# EAGLE design satshield_fresh_start_right_way-2010-01-24 (EAGLE 5.06)
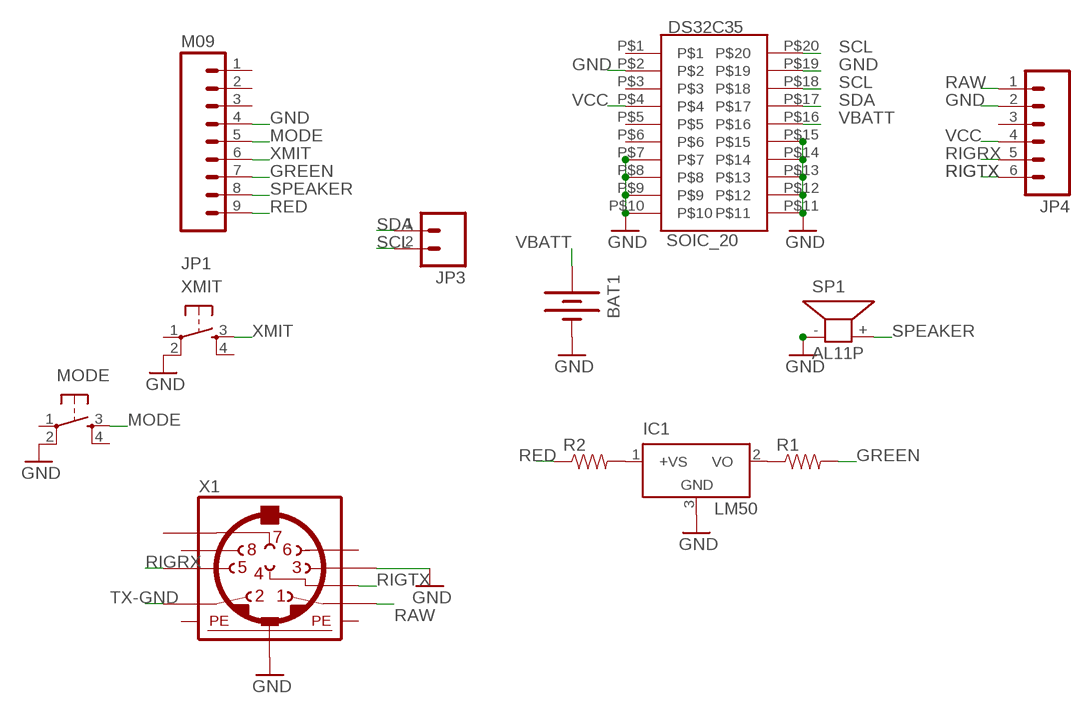
[diagram p0: schematic, sheet 1]

## Parts
BAT1  BATTERY12MM  [BATTCON_12MM]
DS32C35  SOIC_20  [SO20W]
IC1  LM50  [SOT23]
JP1  M09  [1X09]
JP3  M02PTH  [1X02]
JP4  M06SIP  [1X06]
MODE  TAC_SWITCHPTH  [TACTILE-PTH]
R1  RESISTOR1206  [1206]
R2  RESISTOR1206  [1206]
SP1  AL11P  [AL11P]
X1  MINI_DIN_8  [M_DIN8]
XMIT  TAC_SWITCHPTH  [TACTILE-PTH]

## Nets
GND: BAT1.GND(-) DS32C35.P$2 DS32C35.P$7 DS32C35.P$8 DS32C35.P$9 DS32C35.P$10 DS32C35.P$11 DS32C35.P$12 DS32C35.P$13 DS32C35.P$14 DS32C35.P$15 DS32C35.P$19 IC1.3(GND) JP1.4 JP4.2 MODE.2 SP1.- X1.3 X1.SH2(PE2) XMIT.2
GREEN: JP1.7 R1.2
MODE: JP1.5 MODE.3
N$1: IC1.2(VO) R1.1
N$3: IC1.1(+VS) R2.2
RAW: JP4.1 X1.1
RED: JP1.9 R2.1
RIGRX: JP4.5 X1.5
RIGTX: JP4.6 X1.4
SCL: DS32C35.P$18 DS32C35.P$20 JP3.2
SDA: DS32C35.P$17 JP3.1
SPEAKER: JP1.8 SP1.+
TX-GND: X1.2
VBATT: BAT1.PWR@1(+) DS32C35.P$16
VCC: DS32C35.P$4 JP4.4
XMIT: JP1.6 XMIT.3
Unconnected: DS32C35.P$1 DS32C35.P$3 DS32C35.P$5 DS32C35.P$6 JP1.1 JP1.2 JP1.3 JP4.3 MODE.1 MODE.4 X1.6 X1.7 X1.8 XMIT.1 XMIT.4

## Power pins joined to a net without a drawn wire
PE1: X1.SH1(PE1)
PE3: X1.SH3(PE3)

## Library data of the parts
BAT1 = SparkFun:BATTERY: Battery Holders Various common sizes : AA, AAA, 20mm coin cell and 12mm coin cell.
DS32C35 = SparkFun:SOIC_20
IC1 = linear:LM50: SOT-23 Single-Supply Centigrade Temperature Sensor Vout = (10mV/°C x Temp °C) +5mmmV Source: http://cache.national.com/ds/LM/LM50.pdf
JP1 = SparkFun:M09: Header 9 Standard 9-pin 0.1" header. Use with straight break away headers (SKU : PRT-00116), right angle break away headers (PRT-00553), swiss pins (PRT-00743), machine pins (PRT-00117), and female headers (PRT-00115).
JP3 = SparkFun:M02: Header 2 Standard 2-pin 0.1" header. Use with straight break away headers (SKU : PRT-00116), right angle break away headers (PRT-00553), swiss pins (PRT-00743), machine pins (PRT-00117), and female headers (PRT-00115). Molex polarized connector foot print use with SKU : PRT-08233 with associated crimp pins and housings.
JP4 = SparkFun:M06: Header 6 Standard 6-pin 0.1" header. Use with straight break away headers (SKU : PRT-00116), right angle break away headers (PRT-00553), swiss pins (PRT-00743), machine pins (PRT-00117), and female headers (PRT-00115). Molex polarized connector foot print use with SKU : PRT-08094 with associated crimp pins and housings. NOTES ON THE VARIANTS LOCK and LOCK_LONGPADS... This footprint was designed to help hold the alignment of a through-hole component (i.e. 6-pin header) while soldering it into place. You may notice that each hole has been shifted either up or down by 0.005 of an inch from it's more standard position (which is a perfectly straight line). This slight alteration caused the pins (the squares in the middle) to touch the edges of the holes. Because they are alternating, it causes a "brace" to hold the component in place. 0.005 has proven to be the perfect amount of "off-center" position when using our standard breakaway headers. Although looks a little odd when you look at the bare footprint, once you have a header in there, the alteration is very hard to notice. Also, if you push a header all the way into place, it is covered up entirely on the bottom side. This idea of altering the position of holes to aid alignment will be further integrated into the Sparkfun Library for other footprints. It can help hold any component with 3 or more connection pins.
MODE XMIT = SparkFun:TAC_SWITCH: Momentary Switch Button commonly used for reset or general input. Spark Fun Electronics SKU : COM-00097
R1 R2 = SparkFun:RESISTOR: Resistor Basic schematic elements and footprints for 0603, 1206, and PTH 1/10th watt (small) resistors.
SP1 = buzzer:AL11P: SPEAKER Source: Buerklin
X1 = mini_din_update:MINI_DIN_8

## Board
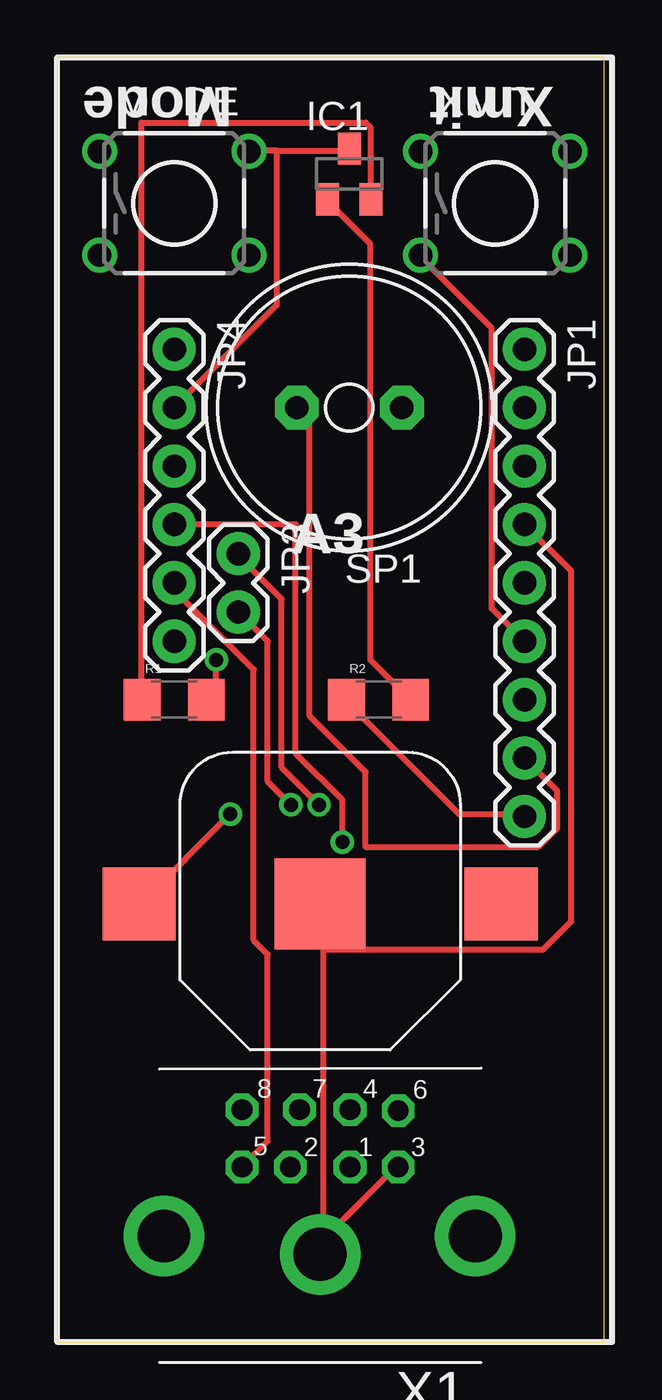
[diagram p1: board, top side]
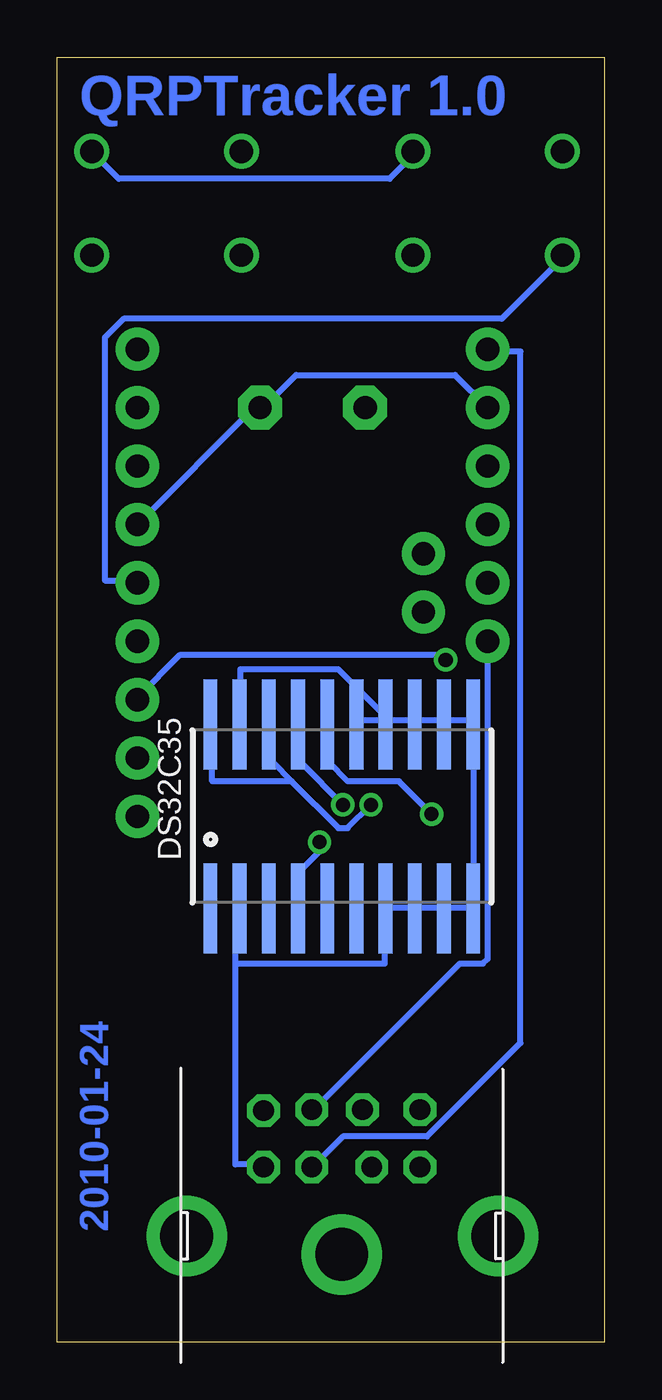
[diagram p2: board, bottom side, seen from below]

Size 23.8 x 55.87 mm. Coordinates in mm from the lower left corner, seen from the top.
Outline: 0,0 23.8,0 23.8,55.87 0,55.87 0,0
Copper layers (1*16): Top 0.035mm / dielectric 1.5mm / Bottom 0.035mm
Design rules "default": minimum track width 10mil, minimum drill 24mil, track to track 8mil, track to pad 8mil, pad to pad 8mil, via to via 8mil, smd to smd 8mil, copper to edge 40mil, drill to drill 8mil, minimum pad ring 10mil, minimum via ring 8mil, stop-mask expansion 4mil, vias tented up to drill 0mil, thermal gap 10mil

### Footprints (pad centres in the part's own frame; a part is rotated, then mirrored left to right if it is on the bottom)
BATTCON_12MM = smd 3.962 x 3.962: GND 0,0 | smd 3.175 x 3.175: PWR@1 -7.874,0; PWR@2 7.874,0
SO20W = smd 0.6 x 3.9: P$1 -5.715,-4; P$2 -4.445,-4; P$3 -3.175,-4; P$4 -1.905,-4; P$5 -0.635,-4; P$6 0.635,-4; P$7 1.905,-4; P$8 3.175,-4; P$9 4.445,-4; P$10 5.715,-4; P$11 5.715,4; P$12 4.445,4; P$13 3.175,4; P$14 1.905,4; P$15 0.635,4; P$16 -0.635,4; P$17 -1.905,4; P$18 -3.175,4; P$19 -4.445,4; P$20 -5.715,4
SOT23 = smd 1 x 1.4: 1 -0.95,-1.1; 2 0.95,-1.1; 3 0,1.1
1X09 = drill 1.016 pad 1.88 round: 1 0,0; 2 2.54,0; 3 5.08,0; 4 7.62,0; 5 10.16,0; 6 12.7,0; 7 15.24,0; 8 17.78,0; 9 20.32,0
1X02 = drill 1.016 pad 1.88 round: 1 0,0; 2 2.54,0
1X06 = drill 1.016 pad 1.88 round: 1 0,0; 2 2.54,0; 3 5.08,0; 4 7.62,0; 5 10.16,0; 6 12.7,0
TACTILE-PTH = drill 1.016 round: 1 -3.251,2.261; 2 3.251,2.261; 3 -3.251,-2.261; 4 3.251,-2.261
1206 = smd 1.6 x 1.8: 1 -1.4,0; 2 1.4,0
AL11P = drill 1.016 pad 1.905 octagon: + 2.286,0; - -2.286,0
M_DIN8 = drill 0.9 pad 1.422 octagon: 1 -1.3,-3.8; 2 1.3,-3.8; 3 -3.4,-3.8; 4 -1.3,-6.3; 5 3.4,-3.8; 6 -3.4,-6.25; 7 0.9,-6.3; 8 3.4,-6.3 | drill 2.3 pad 3.5 round: SH1 6.8,-0.8; SH2 0,0; SH3 -6.75,-0.8

### Placement (x,y rotation side)
BAT1  11.43,19.05 0 top
DS32C35  11.43,22.86 0 bottom
IC1  12.7,50.8 0 top
JP1  20.32,43.18 270 top
JP3  7.87,34.29 270 top
JP4  5.08,43.18 270 top
MODE  5.08,49.53 0 top
R1  5.08,27.94 0 top
R2  13.97,27.94 0 top
SP1  12.7,40.64 180 top
X1  11.43,3.81 180 top
XMIT  19.05,49.53 0 top

### Tracks (layer width: path | path; a pad name or v marks a point on that pad's centre or on a via)
GND
  Top 0.254: 9.55,51.82 8.33,51.82 MODE.2 | 9.55,51.82 12.6,51.82 IC1.3 | JP4.2 9.55,45.11 9.55,51.82 | 11.58,4.47 14.63,7.52 X1.3 | 11.58,4.47 11.58,3.86 X1.SH2 11.58,4.47 | 11.58,4.47 11.58,17.07 | 11.58,17.07 11.58,18.9 BAT1.GND | JP1.4 22.35,33.53 22.35,18.29 21.13,17.07 11.58,17.07
  Bottom 0.254: JP1.4 15.24,40.64 SP1.- 14.83,40.64 13.41,42.06 6.5,42.06 JP4.2 | XMIT.2 22.15,51.61 21.13,50.6 9.35,50.6 8.33,51.61 MODE.2 | 9.35,27.03 8.33,27.03 DS32C35.P$13 8.13,27.03 7.11,27.03 DS32C35.P$12 6.91,27.03 5.89,27.03 DS32C35.P$11 5.69,26.82 5.69,18.9 DS32C35.P$10 5.89,18.9 6.91,18.9 DS32C35.P$9 7.11,18.9 8.13,18.9 DS32C35.P$8 8.33,18.9 9.35,18.9 DS32C35.P$7 9.55,18.69 9.55,16.46 16.05,16.46 | DS32C35.P$15 10.77,27.03 9.55,27.03 DS32C35.P$14 9.35,27.03 | 9.35,27.03 11.58,29.26 15.85,29.26 15.85,27.03 DS32C35.P$19 | 16.05,16.46 16.05,7.72 14.83,7.72 X1.3 | 16.05,16.46 16.05,18.69 DS32C35.P$2
GREEN  (via drill 0.61)
  Top 0.254: v6.91,29.67 6.91,28.45 6.5,28.04 R1.2
  Bottom 0.254: v6.91,29.67 7.11,29.87 18.49,29.87 20.32,28.04 JP1.7
MODE
  Bottom 0.254: MODE.3 1.83,47.14 4.47,44.5 20.93,44.5 21.74,43.69 21.74,33.12 20.32,33.12 JP1.5
N$1
  Top 0.254: IC1.2 13.61,49.78 13.61,52.83 13.41,53.03 3.66,53.03 3.66,28.04 R1.1
N$3
  Top 0.254: IC1.1 11.79,49.58 13.61,47.75 13.61,29.67 15.24,28.04 R2.2
RAW
  Bottom 0.254: X1.1 12.6,7.72 11.38,8.94 7.72,8.94 3.66,13.01 3.66,43.08 5.08,43.08 JP4.1
RED
  Top 0.254: R2.1 12.6,27.84 17.48,22.96 20.32,22.96 JP1.9
RIGRX
  Top 0.254: X1.5 8.13,7.72 9.14,8.74 9.14,16.87 8.53,17.48 8.53,29.26 5.08,32.72 JP4.5
RIGTX
  Bottom 0.254: JP4.6 5.08,16.66 5.28,16.46 6.3,16.46 12.6,10.16 X1.4
SCL  (via drill 0.61)
  Top 0.254: v10.16,23.37 9.14,24.38 9.14,30.48 JP3.2
  Bottom 0.254: v10.16,23.37 11.18,22.35 11.58,22.35 13.61,24.38 | 13.61,24.38 14.43,25.2 14.43,26.82 DS32C35.P$18 | 13.61,24.38 17.07,24.38 17.07,26.82 DS32C35.P$20
SDA  (via drill 0.61)
  Top 0.254: v11.38,23.37 9.75,24.99 9.75,32.31 7.92,34.14 JP3.1
  Bottom 0.254: v11.38,23.37 13.21,25.2 13.21,26.82 DS32C35.P$17
SPEAKER
  Top 0.254: JP1.8 21.74,23.98 21.74,22.35 20.93,21.54 13.41,21.54 13.41,24.79 10.97,27.23 10.97,40.23 10.57,40.64 SP1.+
VBATT  (via drill 0.61)
  Top 0.254: v7.52,22.96 3.66,19.1 BAT1.PWR@1
  Bottom 0.254: v7.52,22.96 8.94,24.38 11.18,24.38 11.99,25.2 11.99,26.82 DS32C35.P$16
VCC  (via drill 0.61)
  Top 0.254: JP4.4 10.36,35.56 10.36,25.6 12.39,23.57 v12.39,21.74
  Bottom 0.254: v12.39,21.74 12.39,21.34 13.21,20.52 13.21,18.9 DS32C35.P$4
XMIT
  Top 0.254: JP1.6 18.9,31.9 18.9,44.09 15.85,47.14 XMIT.3

### Text on the board
Bottom: QRPTracker 1.0 | 2010-01-24
tPlace: Mode | Xmit
_tsilk: A3